# Altium schematic sheet Voltage_Regulators.SchDoc
size A
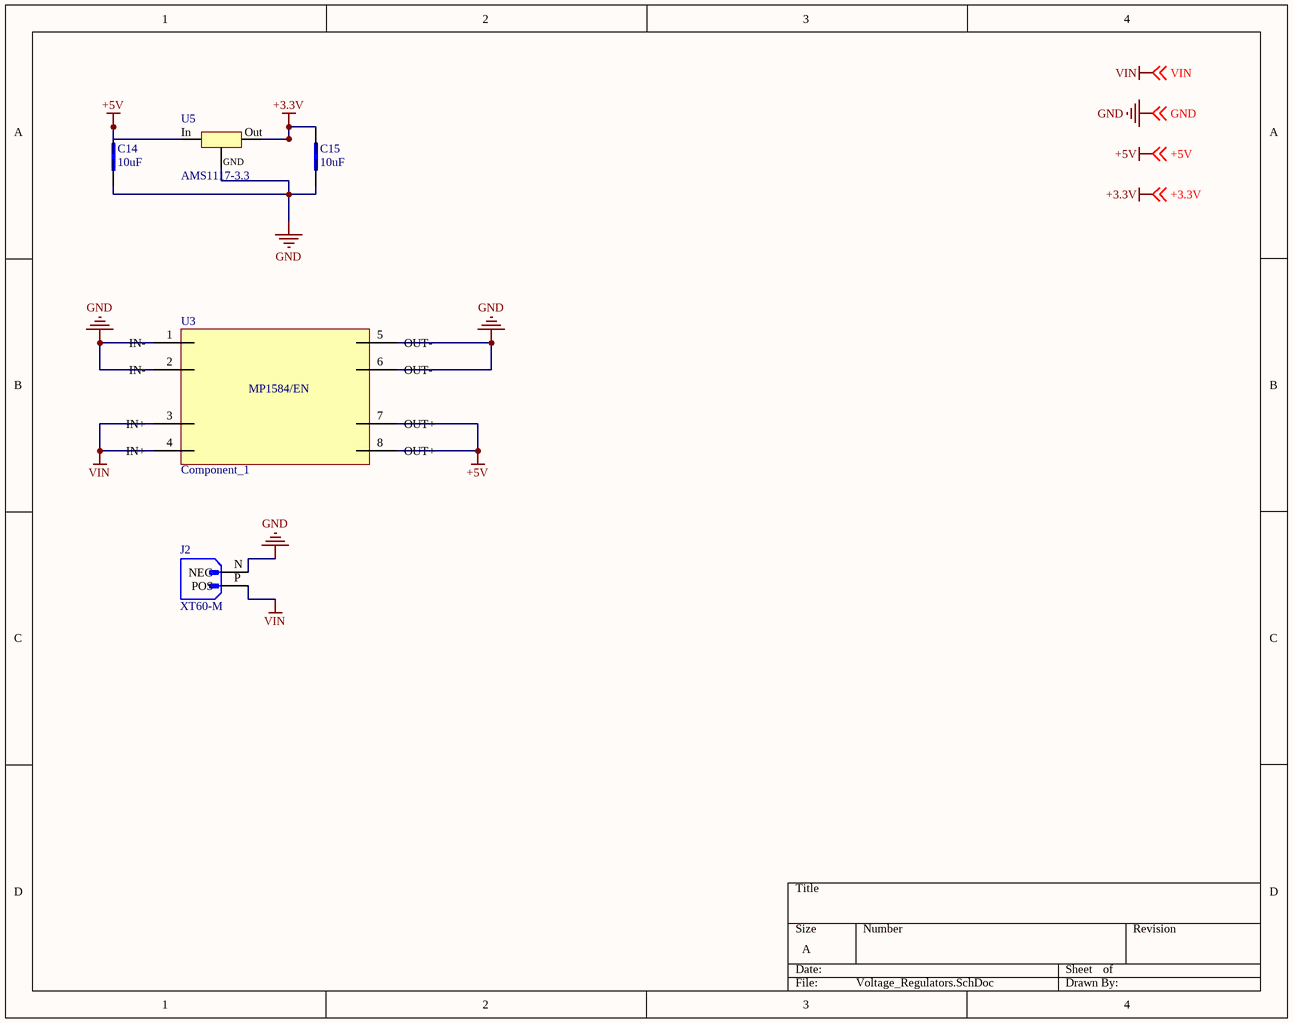
[diagram p0: Voltage_Regulators.SchDoc]

## Parts
C14  10uF  [CAPC1608X90]
C15  10uF  [CAPC1608X90]
J2  XT60-M  [AMASS_XT60-M]
U3  Component_1  [PCBComponent_1]
U5  AMS1117-3.3  [SOT223]

## Nets
+3.3V: C15.1 U5.2 ; off-sheet +3.3V
+5V: C14.1 U3.7(OUT+) U3.8(OUT+) U5.3 ; off-sheet +5V
GND: C14.2 C15.2 J2.N(NEG) U3.1(IN-) U3.2(IN-) U3.5(OUT-) U3.6(OUT-) U5.1 ; off-sheet GND
VIN: J2.P(POS) U3.3(IN+) U3.4(IN+) ; off-sheet VIN

## Notes on the sheet
- (in symbol AMS1117-3.3) In; Out; GND
- (in symbol Component_1) MP1584/EN

## Library data of the parts
C14 C15 = C0603C104K5RACTU: 0.1ÂµF Â±10% 50V Ceramic Capacitor X7R 0603 (1608 Metric); MF: KEMET; SnapEDA_Link: https://www.snapeda.com/parts/C0603C104K5RACTU/KEMET/view-part/52584/?ref=snap; MP: C0603C104K5RACTU; Check_prices: https://www.snapeda.com/parts/C0603C104K5RACTU/KEMET/view-part/52584/?ref=eda; Digi-Key_Part_Number: 399-5089-1-ND; Value: *; Package: 0603 Kemet; Purchase-URL: https://pricing.snapeda.com/search/part/C0603C104K5RACTU/?ref=eda
J2 = XT60-M: Plug; DC supply; XT60; male; PIN: 2; for cable; soldered; 30A; 500V; MF: AMASS; Package: Package; Availability: Not in stock; SnapEDA_Link: https://www.snapeda.com/parts/XT60-M/AMASS/view-part/?ref=snap; Check_prices: https://www.snapeda.com/parts/XT60-M/AMASS/view-part/?ref=eda; MP: XT60-M; Price: None; Value: *